# Altium schematic sheet 25-KeyBoard.SchDoc
size A
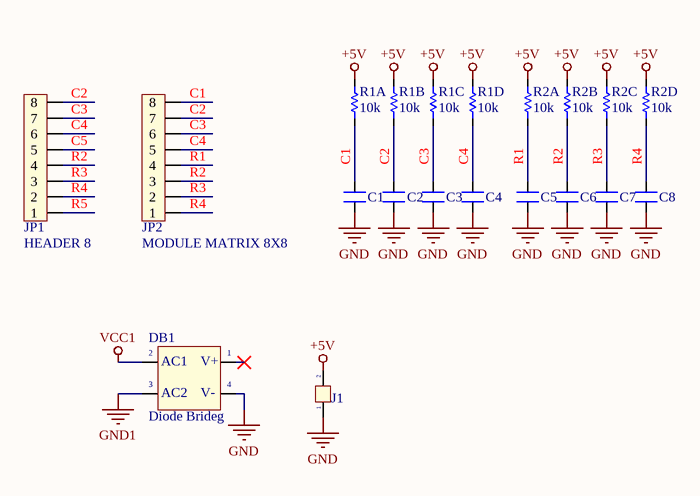
[diagram p0: 25-KeyBoard.SchDoc]

## Parts
C1  104  [C-0805]  (value not drawn)
C2  104  [C-0805]  (value not drawn)
C3  104  [C-0805]  (value not drawn)
C4  104  [C-0805]  (value not drawn)
C5  104  [C-0805]  (value not drawn)
C6  104  [C-0805]  (value not drawn)
C7  104  [C-0805]  (value not drawn)
C8  104  [C-0805]  (value not drawn)
DB1  Diode Brideg  [D-DB-1A-SMD]
J1  Jumper 2  [JP2]  (value not drawn)
JP1  HEADER 8  [JP8]
JP2  MODULE MATRIX 8X8  [JP8]
R1  10k  [R-Array-0603-4]  (parts A,B,C,D of 4)
R2  10k  [R-Array-0603-4]  (parts A,B,C,D of 4)

## Nets
+5V: J1.2 R1.2 R1.4 R1.6 R1.8 R2.2 R2.4 R2.6 R2.8
GND: C1.1 C2.1 C3.1 C4.1 C5.1 C6.1 C7.1 C8.1 DB1.4(-V_OUT) J1.1
GND1: DB1.1(+V_OUT)
VCC1: DB1.2(AC1)
C1: C1.2 JP2.8 R1.1
C2: C2.2 JP1.8 JP2.7 R1.3
C3: C3.2 JP1.7 JP2.6 R1.5
C4: C4.2 JP1.6 JP2.5 R1.7
C5: JP1.5
R1: C5.2 JP2.4 R2.1
R2: C6.2 JP1.4 JP2.3 R2.3
R3: C7.2 JP1.3 JP2.2 R2.5
R4: C8.2 JP1.2 JP2.1 R2.7
R5: JP1.1

Not connected (* = marked no-connect by the designer): DB1 3(AC2)*

## Notes on the sheet
- (in symbol DB) V+; V-

## Library data of the parts
C1-C8 = CN: Value: 0,1uF/300V; Designed by: VanDungEvn
DB1 = DB: Convert AC to DC voltage, 4 pin; Value: Cau 1A
J1 = JP 2: Value: JP 2
JP1 JP2 = JP8: JP8 PIN; Value: JP7
R1 R2 = Res Array 4: RES ARRAY 4 RES 330 OHM 1206; Manufacturer: Panasonic Electronic Components; Manufacturer Part Number: EXB-38V331JV; Digi-Key Part Number: Y9331TR-ND; Link: http://www.digikey.com/product-detail/en/EXB-38V331JV/Y9331TR-ND/256525